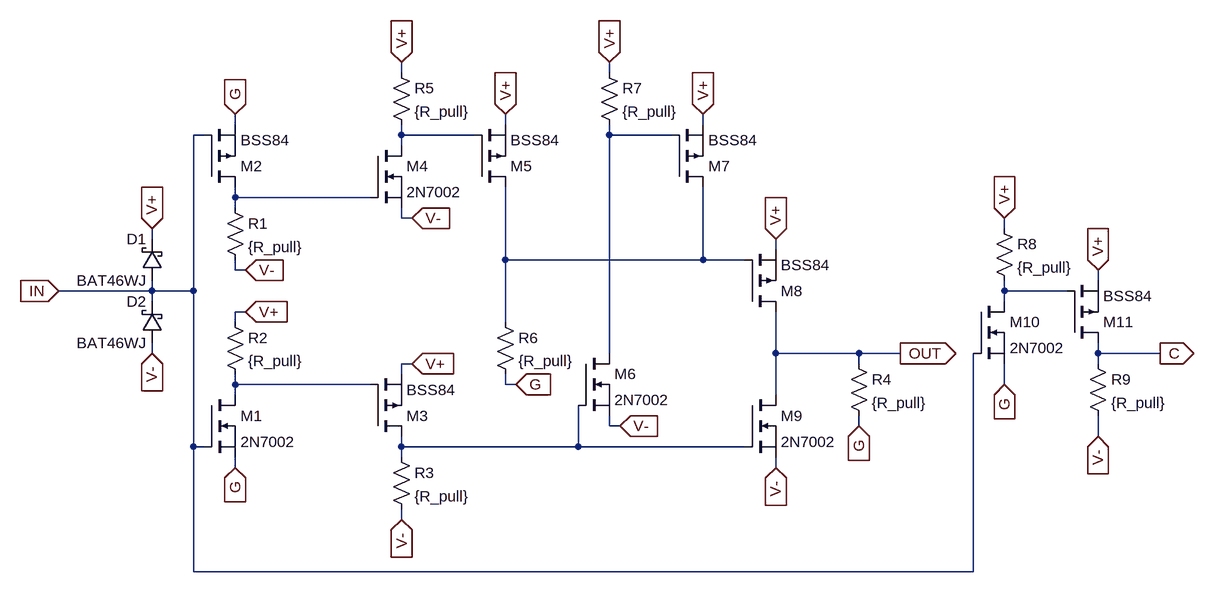
[diagram p0: schematic tri_inc1.asc]
tri_inc1.asc, the LTspice schematic file:
Version 4
SHEET 1 1676 788
WIRE 384 -128 384 -144
WIRE 704 -128 704 -144
WIRE 128 -48 128 -64
WIRE 544 -48 544 -64
WIRE 848 -48 848 -64
WIRE 80 -32 64 -32
WIRE 384 -32 384 -48
WIRE 496 -32 384 -32
WIRE 704 -32 704 -48
WIRE 800 -32 704 -32
WIRE 384 -16 384 -32
WIRE 128 64 128 48
WIRE 336 64 128 64
WIRE 128 80 128 64
WIRE 384 96 384 80
WIRE 400 96 384 96
WIRE 1312 112 1312 96
WIRE 0 128 0 112
WIRE 960 144 960 128
WIRE 544 160 544 48
WIRE 848 160 848 48
WIRE 848 160 544 160
WIRE 912 160 848 160
WIRE 128 176 128 160
WIRE 144 176 128 176
WIRE 1456 192 1456 176
WIRE 0 208 0 192
WIRE 0 208 -144 208
WIRE 64 208 64 -32
WIRE 64 208 0 208
WIRE 1312 208 1312 192
WIRE 1408 208 1312 208
WIRE 0 224 0 208
WIRE 1312 224 1312 208
WIRE 144 240 128 240
WIRE 128 256 128 240
WIRE 544 256 544 160
WIRE 0 304 0 288
WIRE 704 304 704 -32
WIRE 960 304 960 240
WIRE 1088 304 960 304
WIRE 1152 304 1088 304
WIRE 1456 304 1456 288
WIRE 1552 304 1456 304
WIRE 400 320 384 320
WIRE 1088 320 1088 304
WIRE 1456 320 1456 304
WIRE 384 336 384 320
WIRE 128 352 128 336
WIRE 336 352 128 352
WIRE 544 352 544 336
WIRE 560 352 544 352
WIRE 1312 352 1312 320
WIRE 128 368 128 352
WIRE 960 368 960 304
WIRE 704 416 704 400
WIRE 720 416 704 416
WIRE 1088 416 1088 400
WIRE 1456 432 1456 400
WIRE 64 448 64 208
WIRE 80 448 64 448
WIRE 384 448 384 432
WIRE 656 448 656 384
WIRE 656 448 384 448
WIRE 912 448 656 448
WIRE 384 464 384 448
WIRE 128 480 128 464
WIRE 960 480 960 464
WIRE 384 560 384 544
WIRE 64 640 64 448
WIRE 1264 640 1264 304
WIRE 1264 640 64 640
FLAG 0 112 V+
IOPIN 0 112 In
FLAG 0 304 V-
IOPIN 0 304 In
FLAG -144 208 IN
IOPIN -144 208 In
FLAG 1152 304 OUT
IOPIN 1152 304 Out
FLAG 1552 304 C
IOPIN 1552 304 Out
FLAG 400 320 V+
IOPIN 400 320 In
FLAG 384 -144 V+
IOPIN 384 -144 In
FLAG 544 -64 V+
IOPIN 544 -64 In
FLAG 704 -144 V+
IOPIN 704 -144 In
FLAG 848 -64 V+
IOPIN 848 -64 In
FLAG 960 128 V+
IOPIN 960 128 In
FLAG 1312 96 V+
IOPIN 1312 96 In
FLAG 1456 176 V+
IOPIN 1456 176 In
FLAG 144 240 V+
IOPIN 144 240 In
FLAG 128 -64 G
IOPIN 128 -64 In
FLAG 144 176 V-
IOPIN 144 176 In
FLAG 384 560 V-
IOPIN 384 560 In
FLAG 720 416 V-
IOPIN 720 416 In
FLAG 960 480 V-
IOPIN 960 480 In
FLAG 1456 432 V-
IOPIN 1456 432 In
FLAG 400 96 V-
IOPIN 400 96 In
FLAG 128 480 G
IOPIN 128 480 In
FLAG 560 352 G
IOPIN 560 352 In
FLAG 1088 416 G
IOPIN 1088 416 In
FLAG 1312 352 G
IOPIN 1312 352 In
SYMBOL nmos 80 368 R0
SYMATTR InstName M1
SYMATTR Value 2N7002
SYMBOL pmos 80 48 M180
SYMATTR InstName M2
SYMATTR Value BSS84
SYMBOL schottky 16 192 R180
WINDOW 0 24 64 Left 2
WINDOW 3 24 0 Left 2
SYMATTR InstName D1
SYMATTR Value BAT46WJ
SYMATTR Description Diode
SYMATTR Type diode
SYMBOL schottky 16 288 R180
WINDOW 0 24 64 Left 2
WINDOW 3 24 0 Left 2
SYMATTR InstName D2
SYMATTR Value BAT46WJ
SYMATTR Description Diode
SYMATTR Type diode
SYMBOL res 1072 304 R0
SYMATTR InstName R4
SYMATTR Value {R_pull}
SYMBOL res 112 64 R0
SYMATTR InstName R1
SYMATTR Value {R_pull}
SYMBOL res 112 240 R0
SYMATTR InstName R2
SYMATTR Value {R_pull}
SYMBOL pmos 336 432 M180
SYMATTR InstName M3
SYMATTR Value BSS84
SYMBOL res 368 448 R0
SYMATTR InstName R3
SYMATTR Value {R_pull}
SYMBOL nmos 336 -16 R0
SYMATTR InstName M4
SYMATTR Value 2N7002
SYMBOL res 368 -144 R0
SYMATTR InstName R5
SYMATTR Value {R_pull}
SYMBOL pmos 496 48 M180
SYMATTR InstName M5
SYMATTR Value BSS84
SYMBOL res 528 240 R0
SYMATTR InstName R6
SYMATTR Value {R_pull}
SYMBOL nmos 656 304 R0
SYMATTR InstName M6
SYMATTR Value 2N7002
SYMBOL pmos 800 48 M180
SYMATTR InstName M7
SYMATTR Value BSS84
SYMBOL res 688 -144 R0
SYMATTR InstName R7
SYMATTR Value {R_pull}
SYMBOL pmos 912 240 M180
SYMATTR InstName M8
SYMATTR Value BSS84
SYMBOL nmos 912 368 R0
SYMATTR InstName M9
SYMATTR Value 2N7002
SYMBOL nmos 1264 224 R0
SYMATTR InstName M10
SYMATTR Value 2N7002
SYMBOL res 1296 96 R0
SYMATTR InstName R8
SYMATTR Value {R_pull}
SYMBOL pmos 1408 288 M180
SYMATTR InstName M11
SYMATTR Value BSS84
SYMBOL res 1440 304 R0
SYMATTR InstName R9
SYMATTR Value {R_pull}

The netlist it stands for:
* tri_inc1.asc
M1 N006 IN G G 2N7002
M2 N003 IN G G BSS84
D1 IN V+ BAT46WJ
D2 V- IN BAT46WJ
R4 OUT G {R_pull}
R1 N003 V- {R_pull}
R2 V+ N006 {R_pull}
M3 N007 N006 V+ V+ BSS84
R3 N007 V- {R_pull}
M4 N001 N003 V- V- 2N7002
R5 V+ N001 {R_pull}
M5 N004 N001 V+ V+ BSS84
R6 N004 G {R_pull}
M6 N002 N007 V- V- 2N7002
M7 N004 N002 V+ V+ BSS84
R7 V+ N002 {R_pull}
M8 OUT N004 V+ V+ BSS84
M9 OUT N007 V- V- 2N7002
M10 N005 IN G G 2N7002
R8 V+ N005 {R_pull}
M11 C N005 V+ V+ BSS84
R9 C V- {R_pull}
.model D D
.lib standard.dio
.model NMOS NMOS
.model PMOS PMOS
.lib standard.mos
.backanno
.end